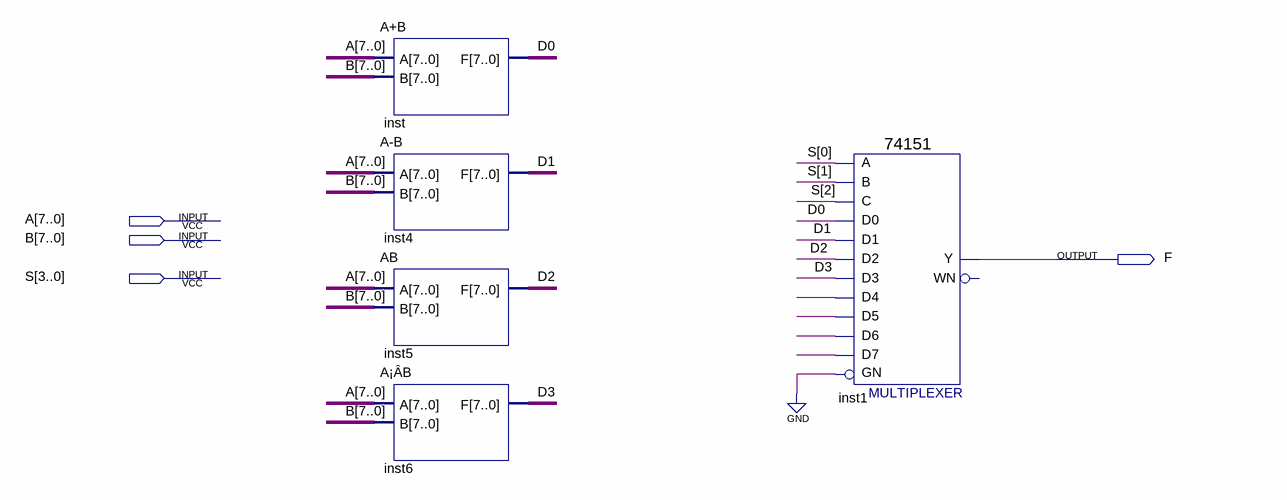
[diagram p0: schematic sheet]
// Quartus schematic 8choice1.bdf as structural Verilog: 5 symbols, 4 pins
module \8choice1  (
  input  [7:0] A,
  input  [7:0] B,
  input  [3:0] S,
  output F
);

  wire D0, D1, D2, D3, undriven, undriven_2, undriven_3, undriven_4;

  \A+B  inst (.A(A), .B(B), .F(D0));
  \A-B  inst4 (.A(A), .B(B), .F(D1));
  AB inst5 (.A(A), .B(B), .F(D2));
  \A¡ÂB  inst6 (.A(A), .B(B), .F(D3));
  \74151  inst1 (
    .GN(1'b0), .C(S[2]), .B(S[1]), .A(S[0]), .D5(undriven_2), .D0(D0), .D1(D1), .D4(undriven), .D3(D3),
    .D2(D2), .D6(undriven_3), .D7(undriven_4), .Y(F));  // open: WN
endmodule
